# EAGLE design RAK833BACKPLANE (EAGLE 9.5.2)
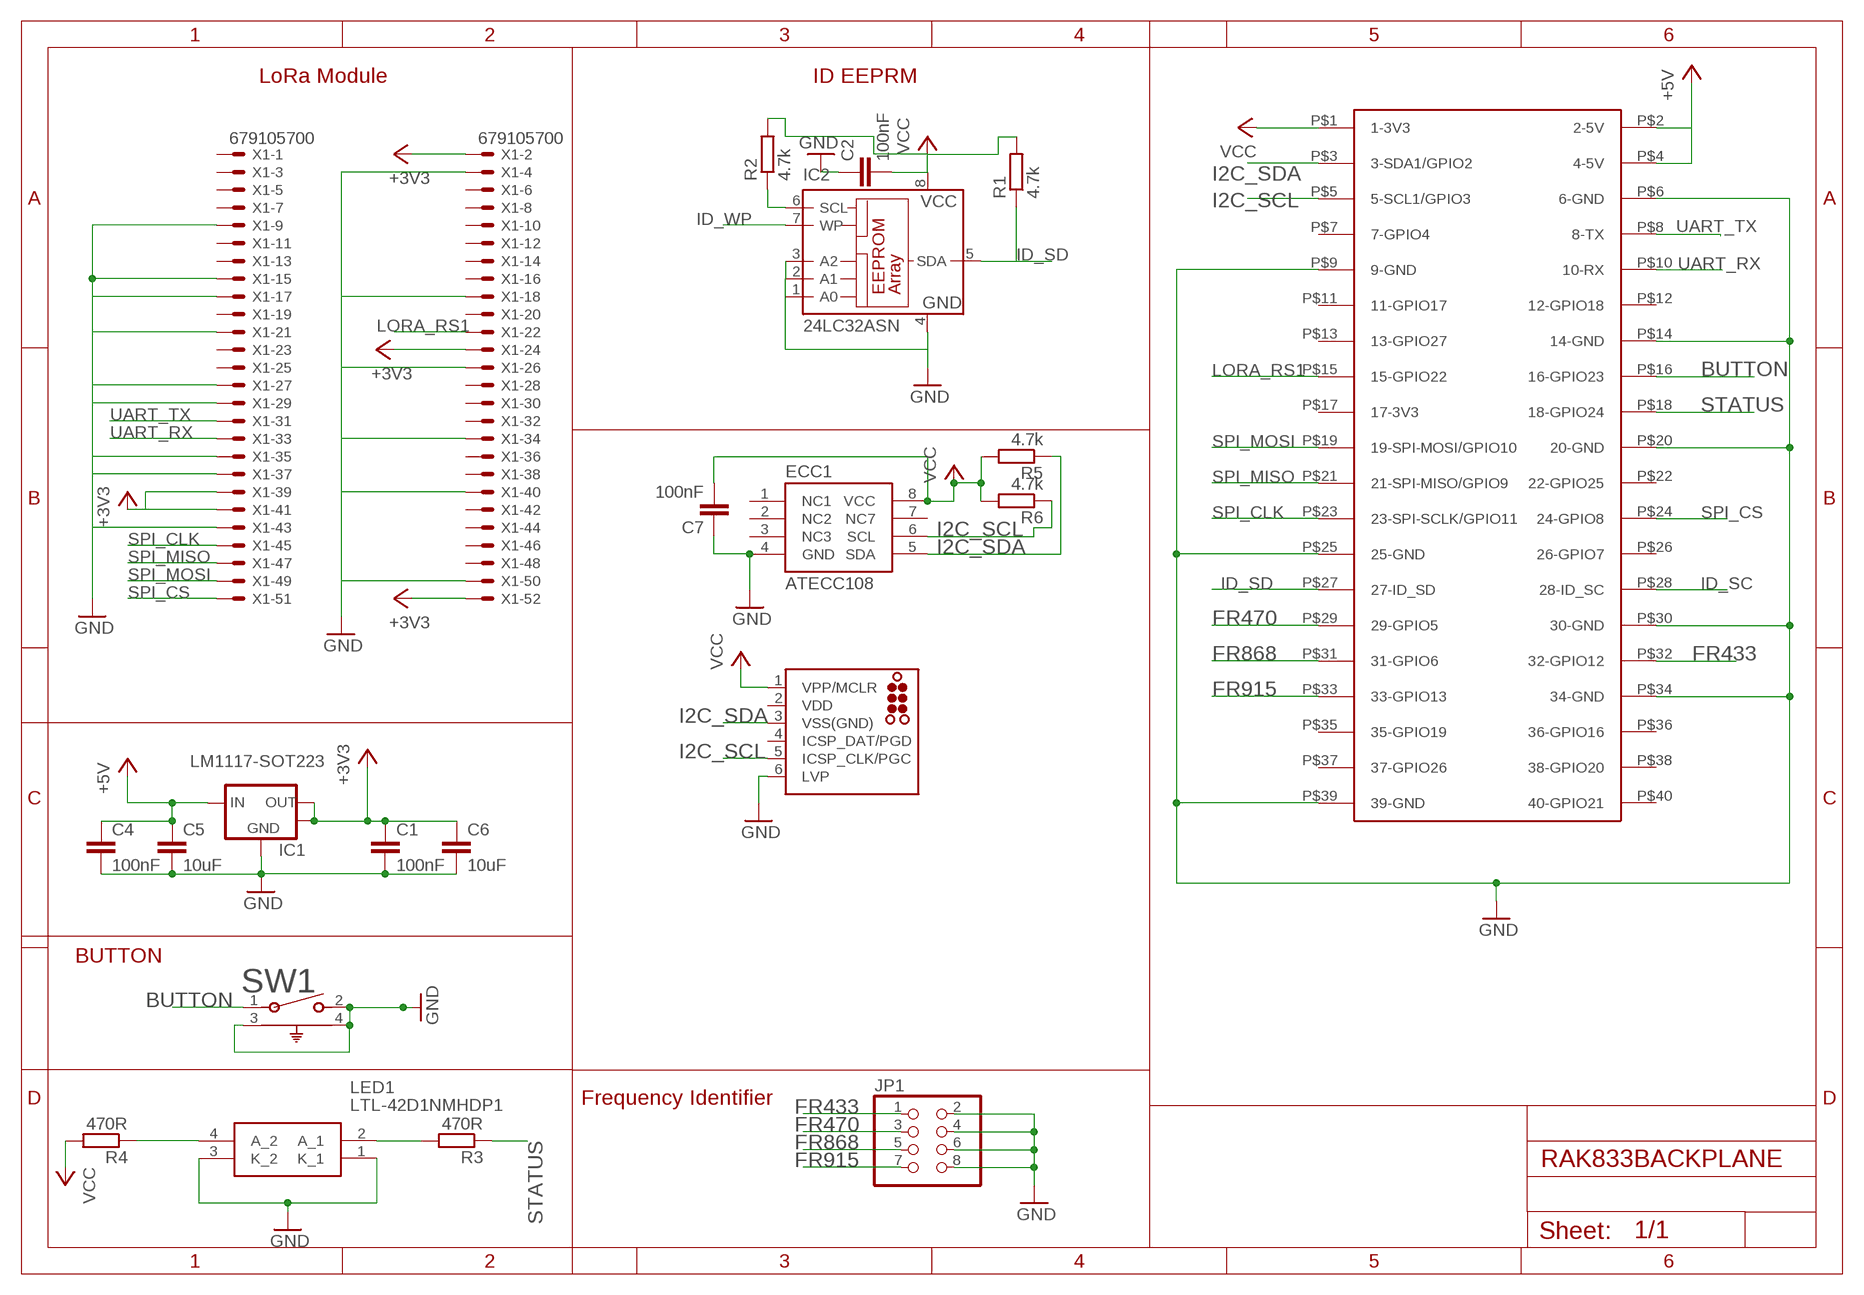
[diagram p0: schematic, sheet 1]

## Parts
C1  100nF  C-EUC0402  [C0402]
C2  100nF  C-EUC0402  [C0402]
C4  100nF  C-EUC0402  [C0402]
C5  10uF  C-EUC0603  [C0603]
C6  10uF  C-EUC0603  [C0603]
C7  100nF  C-EUC0402  [C0402]
ECC1  ATECC108  [SO08]
IC1  LM1117-SOT223  [SOT-223-3]
IC2  24LC32ASN  [SO-08]
J1  TC2030-MCP-NL  [TC2030-MCP-NL]
JP1  PINHD-2X4  [2X04]
LED1  LTL-42D1NMHDP1  [LTL42D1NMHDP1]
R1  4.7k  R-EU_R0402  [R0402]
R2  4.7k  R-EU_R0402  [R0402]
R3  470R  R-EU_R0402  [R0402]
R4  470R  R-EU_R0402  [R0402]
R5  4.7k  R-EU_R0402  [R0402]
R6  4.7k  R-EU_R0402  [R0402]
SW1  1825027-8  [SW2_1825027-C_TEC]
U$2  RASPBERRY-PI+  [RASPBERRY-PI-PLUS-CAM_NOTCH]
X1  679105700  [679105700]

## Nets
+3V3: C1.1 C6.1 IC1.2(VOUT) IC1.4(HEATSINK) X1.2 X1.24 X1.39 X1.41 X1.52
+5V: C4.1 C5.1 IC1.3(VIN) U$2.P$2(2-5V) U$2.P$4(4-5V)
BUTTON: SW1.1 U$2.P$16(16-GPIO23)
FR433: JP1.1 U$2.P$32(32-GPIO12)
FR470: JP1.3 U$2.P$29(29-GPIO5)
FR868: JP1.5 U$2.P$31(31-GPIO6)
FR915: JP1.7 U$2.P$33(33-GPIO13)
GND: C1.2 C2.1 C4.2 C5.2 C6.2 C7.1 ECC1.4(GND) IC1.1(GND) IC2.1(A0) IC2.2(A1) IC2.3(A2) IC2.4(GND) J1.6(LVP) JP1.2 JP1.4 JP1.6 JP1.8 LED1.1(K_1) LED1.3(K_2) SW1.2 SW1.3 SW1.4 U$2.P$6(6-GND) U$2.P$9(9-GND) U$2.P$14(14-GND) U$2.P$20(20-GND) U$2.P$25(25-GND) U$2.P$30(30-GND) U$2.P$34(34-GND) U$2.P$39(39-GND) X1.4 X1.9 X1.15 X1.17 X1.21 X1.26 X1.27 X1.29 X1.34 X1.35 X1.37 X1.40 X1.43 X1.50
I2C_SCL: ECC1.6(SCL) J1.5(ICSP_CLK/PGC) R6.1 U$2.P$5(5-SCL1/GPIO3)
I2C_SDA: ECC1.5(SDA) J1.3(VSS(GND)) R5.1 U$2.P$3(3-SDA1/GPIO2)
ID_SC: IC2.6(SCL) R2.1 U$2.P$28(28-ID_SC)
ID_SD: IC2.5(SDA) R1.1 U$2.P$27(27-ID_SD)
ID_WP: IC2.7(WP)
LORA_RS1: U$2.P$15(15-GPIO22) X1.22
N$1: LED1.4(A_2) R4.1
N$2: LED1.2(A_1) R3.2
N$6: X1.18
SPI_CLK: U$2.P$23(23-SPI-SCLK/GPIO11) X1.45
SPI_CS: U$2.P$24(24-GPIO8) X1.51
SPI_MISO: U$2.P$21(21-SPI-MISO/GPIO9) X1.47
SPI_MOSI: U$2.P$19(19-SPI-MOSI/GPIO10) X1.49
STATUS: R3.1 U$2.P$18(18-GPIO24)
UART_RX: U$2.P$10(10-RX) X1.33
UART_TX: U$2.P$8(8-TX) X1.31
VCC: C2.2 C7.2 ECC1.8(VCC) IC2.8(VCC) J1.1(VPP/MCLR) R1.2 R2.2 R4.2 R5.2 R6.2 U$2.P$1(1-3V3)
Unconnected: ECC1.1(NC1) ECC1.2(NC2) ECC1.3(NC3) ECC1.7(NC7) J1.4(ICSP_DAT/PGD) U$2.P$7(7-GPIO4) U$2.P$11(11-GPIO17) U$2.P$12(12-GPIO18) U$2.P$13(13-GPIO27) U$2.P$17(17-3V3) U$2.P$22(22-GPIO25) U$2.P$26(26-GPIO7) U$2.P$35(35-GPIO19) U$2.P$36(36-GPIO16) U$2.P$37(37-GPIO26) U$2.P$38(38-GPIO20) U$2.P$40(40-GPIO21) X1.1 X1.3 X1.5 X1.6 X1.7 X1.8 X1.10 X1.11 X1.12 X1.13 X1.14 X1.16 X1.19 X1.20 X1.23 X1.25 X1.28 X1.30 X1.32 X1.36 X1.38 X1.42 X1.44 X1.46 X1.48

## Notes on the sheet
- LoRa Module | ID EEPRM
- BUTTON
- Frequency Identifier

## Power pins joined to a net without a drawn wire
VDD: J1.2(VDD)

## Library data of the parts
C1 C2 C4-C7 = resistor:C-EU: CAPACITOR, European symbol
ECC1 = SparkFun-IC-Special-Function:ATECC108: ATECC108 ECDSA with NIST ATECC108: Provides ECDSA with NIST curves P256, B283, and K283. Also, a RNG, 8.5Kb EEPROM. 2.0V - 5.5V. Datasheet <https://cdn.sparkfun.com/datasheets/Dev/Beagle/Atmel-8873S-CryptoAuth-ATECC108-Datasheet-Summary.pdf> SparkFun Products CryptoCape <https://www.sparkfun.com/products/12773> (DEV-12773) SparkFun CryptoShield <https://www.sparkfun.com/products/13183> (DEV-13183); PROD_ID: IC-11982
IC1 = bt_regulator:LM1117: LDO Voltage Regulator NCP1117 series are low dropout positive voltage regulators that are capable of providing an output current that is in excess of 1.0 A with a maximum dropout voltage of 1.2 V at 800 mA over temperature. This series contains nine fixed output voltages of 1.5 V, 1.8 V, 1.9 V, 2.0 V, 2.5 V, 2.85 V, 3.3 V, 5.0 V, and 12 V that have no minimum load requirement to maintain regulation. Also included is an adjustable output version that can be programmed from 1.25 V to 18.8 V with two external resistors. datasheet.pdf <http://www.onsemi.com/pub_link/Collateral/NCP1117-D.PDF> LM1117-N is a series of low dropout voltage regulators of 1.2V at 800mA of load current. It has the same pin-out as Texas Instruments' industry standard LM317. The LM1117-N is available in an adjustable version, available in five fixed voltages, 1.8V, 2.5V, 2.85V, 3.3V, and 5V. The LM1117-N offers current limiting and thermal shutdown. Its circuit includes a zener trimmed to within ±1%. datasheet.pdf <http://www.ti.com/lit/ds/symlink/lm1117-n.pdf>
IC2 = microchip:24*: Serial EEPROM I2C; MF: MICROCHIP; MPN: 24LC32A/SN; OC_FARNELL: 9758003; OC_NEWARK: 33C2976
J1 = One_Dimensional_Pong:TC2030: TAG-CONNECT ICSP Connector Manufacturer: Tag-Connect <http://www.tag-connect.com> Cable for easy In-Circuit Serial Programming. Designed for Microchip ICD2, suitable for many others. Two variants - one "with legs" (for hands-free fit on PCB) and another "without legs" for quick programming. PAD Description 1 MCLR/Vpp 2 Vdd 3 GND 4 PGD (ISPDAT) 5 PGC (ISPCLK) 6 nc (used for LVP) ©2009 ROFA.cz - modified and updated by Robert Darlington ‹rdarlington@gmail.com›
JP1 = pinhead:PINHD-2X4: PIN HEADER
LED1 = LTL-42D1NMHDP1:LTL-42D1NMHDP1: LED Circuit Board Indicators Housing LED ThruHole 3mm 2Lvl Grn/Yellow Source: Datasheet <https://datasheet.datasheetarchive.com/originals/distributors/Datasheets-305/79387.pdf>; ARROW_PART_NUMBER: LTL-42D1NMHDP1; ARROW_PRICE-STOCK: https://www.arrow.com/en/products/ltl-42d1nmhdp1/lite-on-technology; DESCRIPTION: LED Circuit Board Indicators Housing LED ThruHole 3mm 2Lvl Grn/Yellow; HEIGHT: 9.6mm; MANUFACTURER_NAME: Lite-On; MANUFACTURER_PART_NUMBER: LTL-42D1NMHDP1; MOUSER_PART_NUMBER: 859-LTL-42D1NMHDP1; MOUSER_PRICE-STOCK: https://www.mouser.co.uk/ProductDetail/Lite-On/LTL-42D1NMHDP1?qs=WxFF5lh7QM1L2xMrizlF%2FQ%3D%3D
R1-R6 = resistor:R-EU_: RESISTOR, European symbol
SW1 = ryanteck:1825027-8; BUILT_BY: EMA_UL_Team; CONFIGURATION__POLE-THROW_: Single Pole - Single Throw; COPYRIGHT: Copyright (C) 2016 Accelerated Designs. All rights reserved; DESCRIPTION: FSMRA3JH04=R/A,TACT PB SW,160G; MANUFACTURER_PART_NUMBER: 1825027-8; MAX_SWITCHING_CURRENT: -; MAX_SWITCHING_VOLTAGE_AC_: -; PRODUCT_TYPE: Switch; SOURCELIBRARY: TE_Connectivity-2018-03-16; SWITCH_TYPE: Tactile Switches; TE_PART_NUMBER: 1825027-8; VENDOR: TE Connectivity
U$2 = Ava:RASPBERRY-PI+: Samtec SSW-120-01-T-D
X1 = con-molex-3:679105700: MINI PCI EXPRESS CONNECTOR 0.8MM PITCH, 52 CIRCUIT Source: http://www.molex.com/pdm_docs/sd/679105700_sd.pdf; MPN: 67910-5700; OC_FARNELL: unknown; OC_NEWARK: 93M2128

## Board
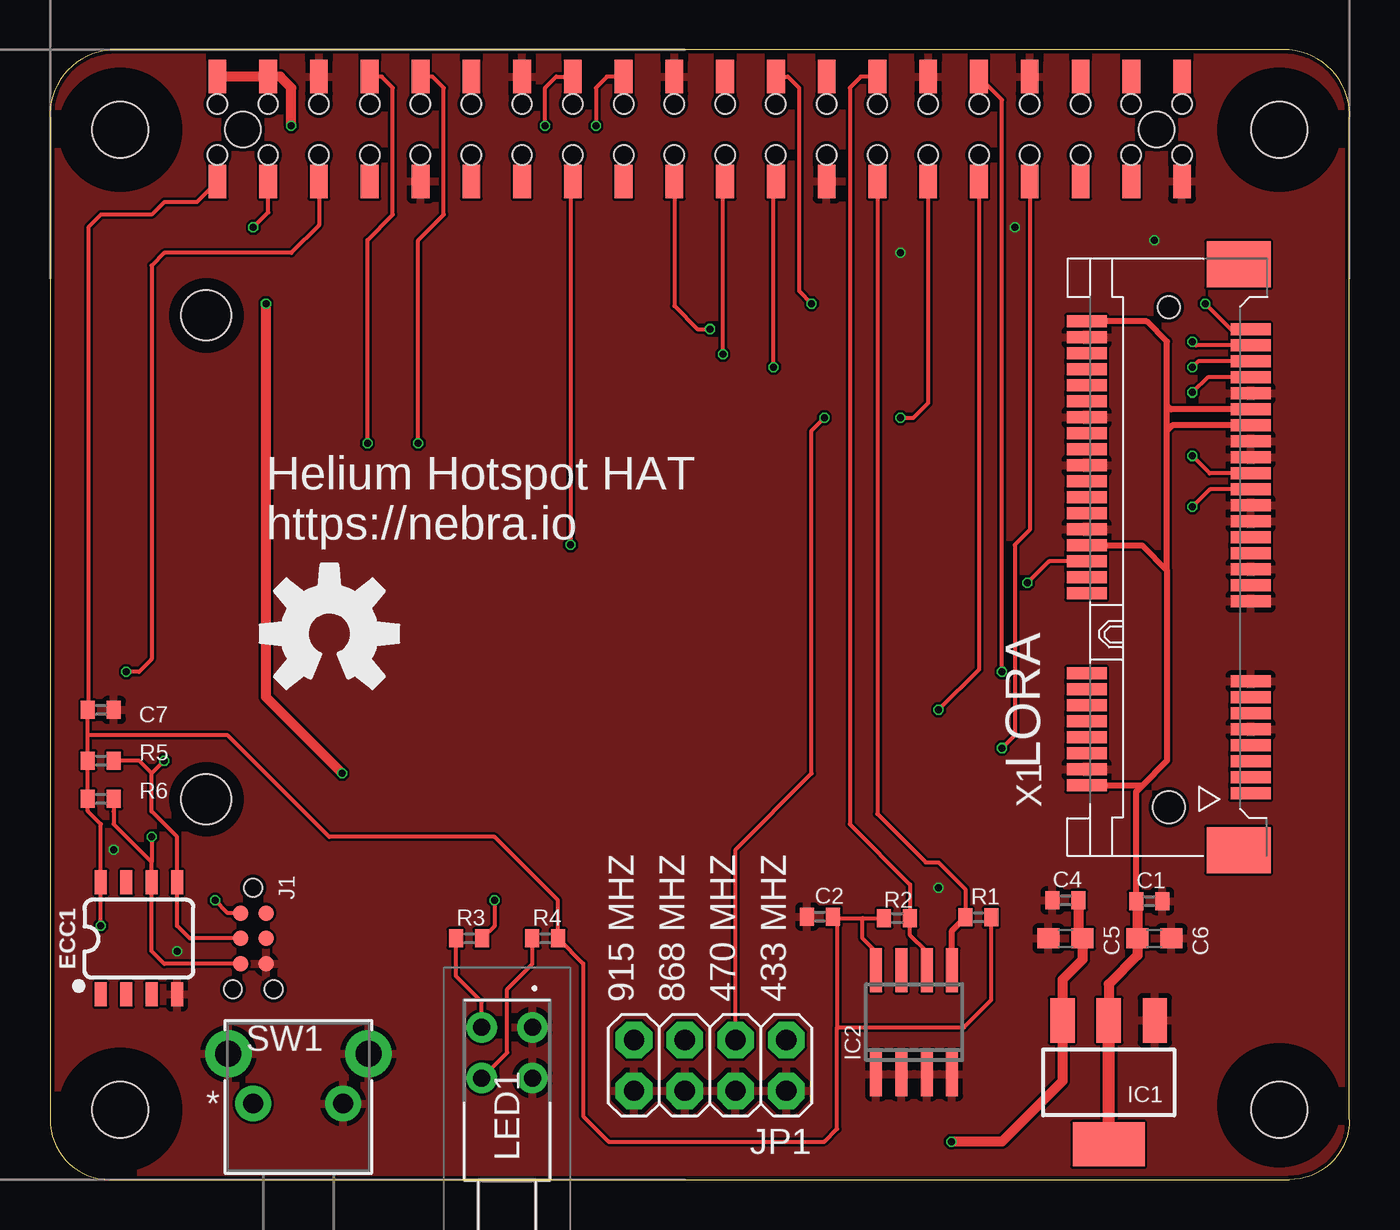
[diagram p1: board, top side]
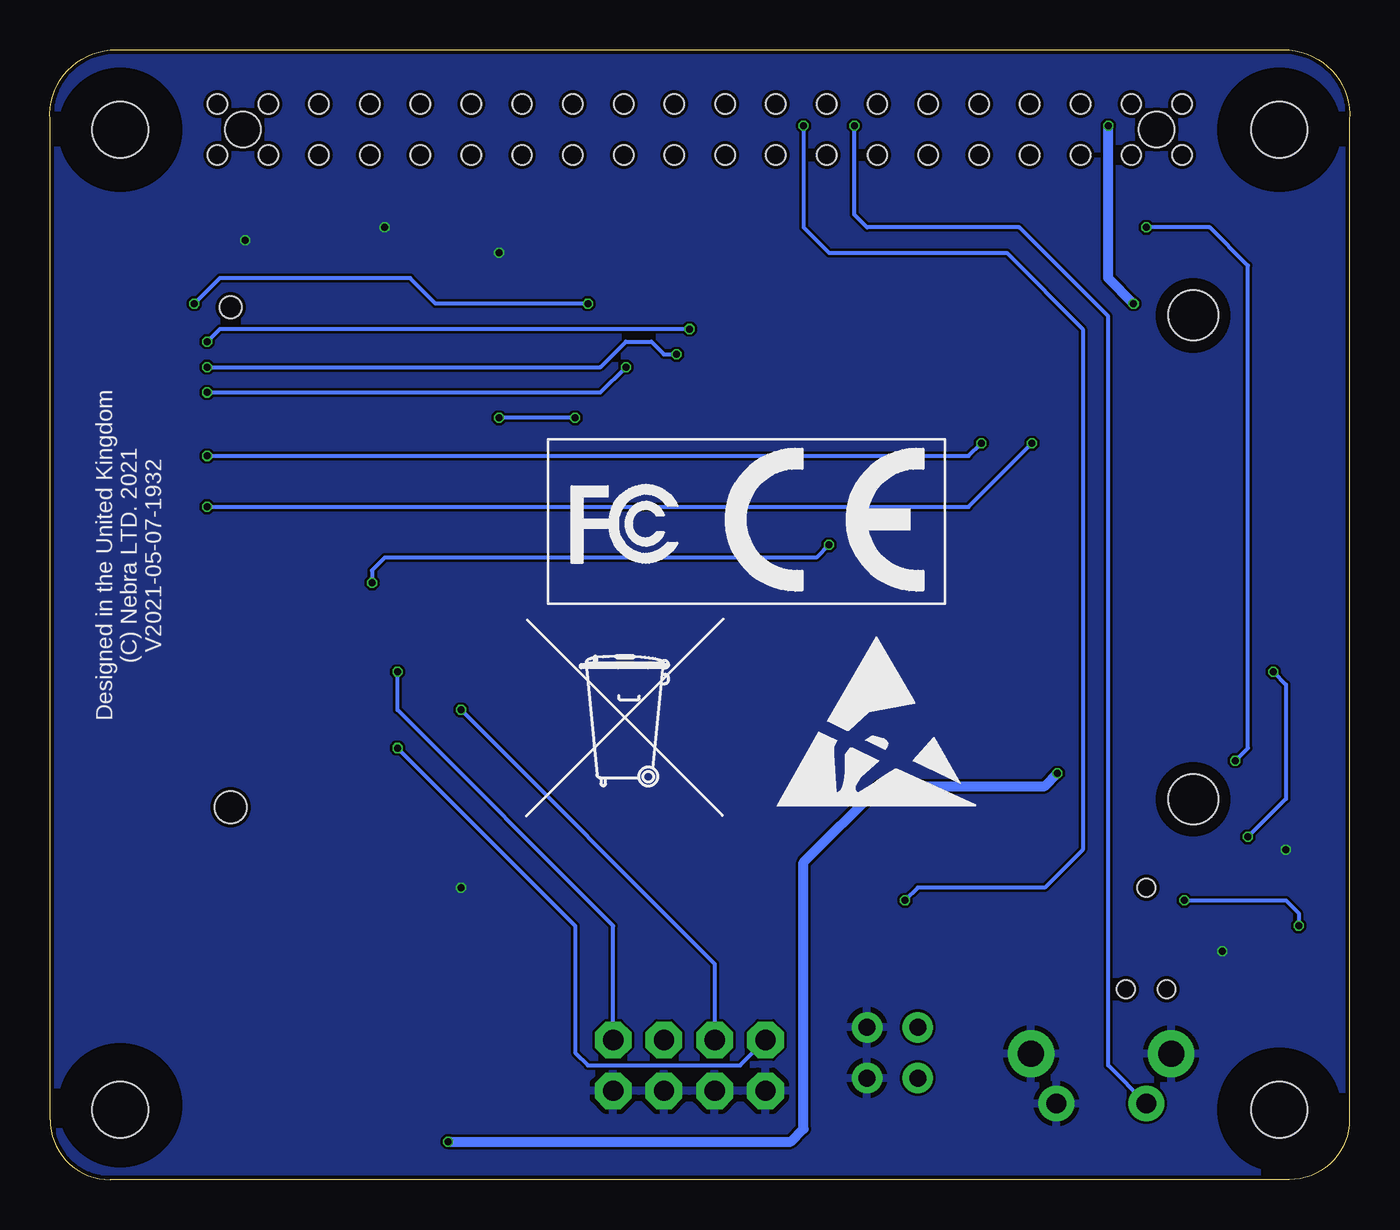
[diagram p2: board, bottom side, seen from below]

Size 65.02 x 56.5 mm. Coordinates in mm from the lower left corner, seen from the top.
Outline: 65.01,3 65.01,53 arc90 62.01,56.5 3.01,56.5 arc90 0.01,53 0.01,3 arc90 3.01,0 62.01,0 arc90 65.01,3
Copper layers (1*16): Top 0.035mm / dielectric 1.6mm / Bottom 0.035mm
Design rules "jlcpcb-2layers": minimum track width 5mil, minimum drill 0.3mm, track to track 5mil, track to pad 5mil, pad to pad 5mil, via to via 5mil, smd to smd 5mil, copper to edge 0.2mm, drill to drill 6mil, minimum pad ring 10mil, minimum via ring 3mil, stop-mask expansion 4mil, vias tented up to drill 0mil, thermal gap 10mil
Holes 2.8 mm at 3.51,52.5 61.51,52.5 3.51,3.5 61.51,3.5
tRestrict: area 2,51 to 5.1,54; area 60,2.2 to 63.1,5.3; area 2,1.9 to 5.1,5; area 60,51 to 63.1,54
bRestrict: area 60,51 to 63.1,54; area 2,1.9 to 5.1,5; area 2,51 to 5.1,54; area 2,1.9 to 5.1,5; area 60,2.2 to 63.1,5.3

### Footprints (pad centres in the part's own frame; a part is rotated, then mirrored left to right if it is on the bottom)
C0402 = smd 0.7 x 0.9: 1 -0.65,0; 2 0.65,0
C0603 = smd 1.1 x 1: 1 -0.85,0; 2 0.85,0
SO08 = smd 0.6 x 1.2: 1 -1.905,-2.8; 2 -0.635,-2.8; 3 0.635,-2.8; 4 1.905,-2.8; 5 1.905,2.8; 6 0.635,2.8; 7 -0.635,2.8; 8 -1.905,2.8
SOT-223-3 = smd 1.219 x 2.235: 1 -2.311,-3.099; 2 0,-3.099; 3 2.311,-3.099 | smd 3.6 x 2.2: 4 0,3.099
SO-08 = smd 0.6 x 2.2: 1 -1.905,-2.6; 2 -0.635,-2.6; 3 0.635,-2.6; 4 1.905,-2.6; 5 1.905,2.6; 6 0.635,2.6; 7 -0.635,2.6; 8 -1.905,2.6
TC2030-MCP-NL = smd 0.787 x 0.787: 1 1.27,-0.635; 2 1.27,0.635; 3 2.54,-0.635; 4 2.54,0.635; 5 3.81,-0.635; 6 3.81,0.635 | hole 0.889: 0,0; 5.08,-1.016; 5.08,1.016
2X04 = drill 1.016 octagon: 1 -3.81,-1.27; 2 -3.81,1.27; 3 -1.27,-1.27; 4 -1.27,1.27; 5 1.27,-1.27; 6 1.27,1.27; 7 3.81,-1.27; 8 3.81,1.27
LTL42D1NMHDP1 = drill 0.85 pad 1.381: 1 0,0; 2 0,2.54; 3 -2.54,0; 4 -2.54,2.54
R0402 = smd 0.7 x 0.9: 1 -0.65,0; 2 0.65,0
SW2_1825027-C_TEC = drill 0.991 pad 1.499: 1 0,0; 2 4.496,0 | drill 1.295 pad 1.803: 3 -1.245,2.489; 4 5.766,2.489
RASPBERRY-PI-PLUS-CAM_NOTCH = smd 0.889 x 1.68: P$1 -23.97,-2.225; P$2 -23.97,3.015; P$3 -21.43,-2.225; P$4 -21.43,3.015; P$5 -18.89,-2.225; P$6 -18.89,3.015; P$7 -16.35,-2.225; P$8 -16.35,3.015; P$9 -13.81,-2.225; P$10 -13.81,3.015; P$11 -11.27,-2.225; P$12 -11.27,3.015; P$13 -8.73,-2.225; P$14 -8.73,3.015; P$15 -6.19,-2.225; P$16 -6.19,3.015; P$17 -3.65,-2.225; P$18 -3.65,3.015; P$19 -1.11,-2.225; P$20 -1.11,3.015; P$21 1.43,-2.225; P$22 1.43,3.015; P$23 3.97,-2.225; P$24 3.97,3.015; P$25 6.51,-2.225; P$26 6.51,3.015; P$27 9.05,-2.225; P$28 9.05,3.015; P$29 11.59,-2.225; P$30 11.59,3.015; P$31 14.13,-2.225; P$32 14.13,3.015; P$33 16.67,-2.225; P$34 16.67,3.015; P$35 19.21,-2.225; P$36 19.21,3.015; P$37 21.75,-2.225; P$38 21.75,3.015; P$39 24.29,-2.225; P$40 24.29,3.015 | hole 1.78: -22.7,0.37; 23.02,0.37 | hole 0.97: -23.97,1.64; -21.43,1.64; -18.89,1.64; -16.35,1.64; -13.81,1.64; -11.27,1.64; -8.73,1.64; -6.19,1.64; -3.65,1.64; -1.11,1.64; 1.43,1.64; 3.97,1.64; 6.51,1.64; 9.05,1.64; 11.59,1.64; 14.13,1.64; 16.67,1.64; 19.21,1.64; 21.75,1.64; 24.29,1.64; -23.97,-0.9; -21.43,-0.9; -18.89,-0.9; -16.35,-0.9; -13.81,-0.9; -11.27,-0.9; -8.73,-0.9; -6.19,-0.9; -3.65,-0.9; -1.11,-0.9; 1.43,-0.9; 3.97,-0.9; 6.51,-0.9; 9.05,-0.9; 11.59,-0.9; 14.13,-0.9; 16.67,-0.9; 19.21,-0.9; 21.75,-0.9; 24.29,-0.9
679105700 = smd 0.6 x 2: 1 0.7,-4.1; 2 1.1,4.1; 3 1.5,-4.1; 4 1.9,4.1; 5 2.3,-4.1; 6 2.7,4.1; 7 3.1,-4.1; 8 3.5,4.1; 9 3.9,-4.1; 10 4.3,4.1; 11 4.7,-4.1; 12 5.1,4.1; 13 5.5,-4.1; 14 5.9,4.1; 15 6.3,-4.1; 16 6.7,4.1; 17 10.3,-4.1; 18 10.7,4.1; 19 11.1,-4.1; 20 11.5,4.1; 21 11.9,-4.1; 22 12.3,4.1; 23 12.7,-4.1; 24 13.1,4.1; 25 13.5,-4.1; 26 13.9,4.1; 27 14.3,-4.1; 28 14.7,4.1; 29 15.1,-4.1; 30 15.5,4.1; 31 15.9,-4.1; 32 16.3,4.1; 33 16.7,-4.1; 34 17.1,4.1; 35 17.5,-4.1; 36 17.9,4.1; 37 18.3,-4.1; 38 18.7,4.1; 39 19.1,-4.1; 40 19.5,4.1; 41 19.9,-4.1; 42 20.3,4.1; 43 20.7,-4.1; 44 21.1,4.1; 45 21.5,-4.1; 46 21.9,4.1; 47 22.3,-4.1; 48 22.7,4.1; 49 23.1,-4.1; 50 23.5,4.1; 51 23.9,-4.1; 52 24.3,4.1 | smd 2.3 x 3.2: M1 27.15,-3.5; M2 -2.15,-3.5 | hole 1.6: 0,0 | hole 1.1: 25,0 | hole 2.5: 0.4,48.15; 24.6,48.15

### Placement (x,y rotation side)
C1  55,13.93 0 top
C2  38.52,13.16 0 top
C4  50.81,13.97 180 top
C5  50.81,12.06 180 top
C6  55.25,12.06 0 top
C7  2.55,23.5 180 top
ECC1  4.45,12.06 0 top
IC1  52.97,4.87 180 top
IC2  43.23,7.87 0 top
J1  10.17,14.61 270 top
JP1  33.03,5.71 180 top
LED1  24.14,7.62 90 top
R1  46.45,13.12 0 top
R2  42.38,13.08 180 top
R3  20.96,12.06 180 top
R4  24.77,12.06 0 top
R5  2.55,20.95 180 top
R6  2.55,19.05 180 top
SW1  10.17,3.81 0 top
U$1  [TONNE_10.00]  36.37,21.12 0 bottom
U$2  32.35,52.15 0 top
U$3  [ESD_10.00]  28.75,18.58 0 bottom
U$4  [CE_7.3MM]  31.29,29.38 0 bottom
U$5  [FCC_20X8.35MM]  40.18,28.74 0 bottom
U$6  [OSHW-LOGO-L]  13.98,27.3 0 top
X1  55.97,18.63 90 top

### Tracks (layer width: path | path; a pad name or v marks a point on that pad's centre or on a via)
+3V3
  Top 0.305: C1.1 54.35,19.41 54.62,19.68 | 54.62,19.68 55.89,20.95 55.89,30.48 | X1.2 54.58,19.73 54.62,19.68 | X1.24 54.64,31.73 55.89,30.48 | X1.52 54.87,42.93 55.89,41.91 55.89,38.73 | 55.89,30.48 55.89,37.47 | 55.89,37.47 55.89,38.73 | X1.41 56.1,38.53 55.89,38.73 | X1.39 56.15,37.73 55.89,37.47
  Top 0.508: C1.1 54.4,13.88 C6.1 54.4,11.21 52.97,9.78 IC1.2
  Top 0.61: IC1.4 IC1.2
+5V  (via drill 0.35)
  Top 0.508: C4.1 51.46,12.27 C5.1 51.66,11.01 50.66,10.01 IC1.3 50.66,4.93 47.63,1.91 v45.09,1.91 | v14.61,20.32 10.8,24.13 v10.8,43.81 | v12.07,52.7 12.07,54.61 11.52,55.16 U$2.P$4 U$2.P$2
  Bottom 0.508: v45.09,1.91 27.95,1.91 27.31,2.54 27.31,15.88 23.5,19.68 15.25,19.68 v14.61,20.32 | v10.8,43.81 12.07,45.09 v12.07,52.7
BUTTON  (via drill 0.35)
  Top 0.203: v24.77,52.7 24.77,54.61 25.33,55.16 U$2.P$16
  Bottom 0.203: SW1.1 12.07,5.71 12.07,43.18 16.52,47.62 24.14,47.62 24.77,48.26 v24.77,52.7
FR433  (via drill 0.35)
  Top 0.203: v47.63,25.4 47.63,54.01 U$2.P$32
  Bottom 0.203: JP1.1 36.84,12.7 47.63,23.5 v47.63,25.4
FR470  (via drill 0.35)
  Top 0.203: JP1.3 34.3,16.51 38.11,20.32 38.11,37.47 v38.74,38.1 | v42.55,38.1 43.19,38.1 43.94,38.85 U$2.P$29
  Bottom 0.203: v38.74,38.1 v42.55,38.1
FR868  (via drill 0.35)
  Top 0.203: U$2.P$31 46.48,25.51 v44.46,23.5
  Bottom 0.203: v44.46,23.5 31.76,10.79 JP1.5
FR915  (via drill 0.35)
  Top 0.203: U$2.P$33 49.02,32.5 48.27,31.75 48.27,22.23 v47.63,21.59
  Bottom 0.203: v47.63,21.59 38.74,12.7 38.74,6.35 38.11,5.71 30.49,5.71 JP1.7
GND  (via drill 0.35)
  other vias: 42.55,46.35 44.46,14.61 48.27,47.62 55.25,46.99 3.18,16.51 6.36,11.43
  pour Top: -1.65,58.72 -2,-1.77 67.57,-1.24 68.37,59.3
  pour Bottom: -1.82,59.31 -1.55,-1.9 66.81,-1.52 66.02,59.86
I2C_SCL  (via drill 0.35)
  Top 0.203: J1.5 5.72,10.79 5.09,11.43 ECC1.6 5.09,15.88 | 5.09,15.88 3.18,17.78 3.18,18.41 3.2,18.43 R6.1 | U$2.P$5 13.46,47.74 12.07,46.35 5.72,46.35 5.09,45.72 5.09,26.04 4.45,25.4 v3.82,25.4 | v5.09,17.14 5.09,15.88
  Bottom 0.203: v3.82,25.4 3.18,24.77 3.18,19.05 v5.09,17.14
I2C_SDA  (via drill 0.35)
  Top 0.203: J1.3 6.99,12.06 6.36,12.7 ECC1.5 6.36,17.14 5.09,18.41 5.09,20.32 | 5.09,20.32 4.45,20.95 R5.1 | 5.09,20.32 v5.72,20.95 | U$2.P$3 10.92,48.37 v10.17,47.62
  Bottom 0.203: v5.72,20.95 5.09,21.59 5.09,45.72 6.99,47.62 v10.17,47.62
ID_SC
  Top 0.203: IC2.6 43.87,11.39 43.03,12.22 R2.1 43.03,14.76 40.01,17.78 40.01,54.61 40.57,55.16 U$2.P$28
ID_SD
  Top 0.203: U$2.P$27 41.4,18.3 43.82,15.88 44.46,15.88 45.8,14.54 R1.1
  Top 0.305: IC2.5 45.14,12.46 R1.1
LORA_RS1  (via drill 0.35)
  Top 0.203: U$2.P$15 26.04,49.81 v26.04,31.75 | X1.22 49.99,30.93 v48.9,29.84
  Bottom 0.203: v26.04,31.75 26.68,31.11 48.27,31.11 48.9,30.48 v48.9,29.84
N$1
  Top 0.203: LED1.4 22.87,6.35 22.87,9.53 24.14,10.79 R4.1
N$2
  Top 0.203: LED1.2 21.6,8.89 20.31,10.18 R3.2
SPI_CLK  (via drill 0.35)
  Top 0.203: X1.45 57.92,40.13 v57.16,39.37 | v36.2,40.64 36.2,49.81 U$2.P$23
  Bottom 0.203: v57.16,39.37 37.47,39.37 v36.2,40.64
SPI_CS  (via drill 0.35)
  Top 0.203: U$2.P$24 36.92,55.16 37.47,54.61 37.47,44.45 v38.11,43.81 | v57.79,43.81 59.08,42.53 X1.51
  Bottom 0.203: v38.11,43.81 45.73,43.81 47,45.09 56.52,45.09 v57.79,43.81
SPI_MISO  (via drill 0.35)
  Top 0.203: X1.47 57.45,40.93 v57.16,40.64 | v33.66,41.27 33.66,49.81 U$2.P$21
  Bottom 0.203: v57.16,40.64 37.47,40.64 36.2,41.91 34.93,41.91 34.3,41.27 v33.66,41.27
SPI_MOSI  (via drill 0.35)
  Top 0.203: U$2.P$19 31.24,43.7 32.39,42.55 v33.03,42.55 | X1.49 57.34,41.73 v57.16,41.91
  Bottom 0.203: v33.03,42.55 56.52,42.55 v57.16,41.91
STATUS  (via drill 0.35)
  Top 0.203: U$2.P$18 27.87,55.16 27.31,54.61 v27.31,52.7 | v22.23,13.97 22.23,12.69 R3.1
  Bottom 0.203: v27.31,52.7 27.31,47.62 26.04,46.35 17.15,46.35 13.34,42.55 13.34,16.51 15.25,14.61 21.6,14.61 v22.23,13.97
UART_RX  (via drill 0.35)
  Top 0.203: X1.33 58.03,35.33 v57.16,36.2 | v18.42,36.83 18.42,46.99 19.69,48.26 19.69,54.61 19.14,55.16 U$2.P$10
  Bottom 0.203: v18.42,36.83 19.06,36.2 v57.16,36.2
UART_TX  (via drill 0.35)
  Top 0.203: X1.31 58.03,34.53 v57.16,33.66 | v15.88,36.83 15.88,46.99 17.15,48.26 17.15,54.61 16.6,55.16 U$2.P$8
  Bottom 0.203: v57.16,33.66 19.06,33.66 v15.88,36.83
VCC  (via drill 0.35)
  Top 0.203: 1.9,22.23 C7.2 1.91,23.51 1.91,47.62 2.55,48.26 5.09,48.26 5.72,48.9 7.35,48.9 U$2.P$1 | 1.9,22.23 8.9,22.23 13.98,17.14 22.23,17.14 25.41,13.97 25.41,12.08 R4.2 26.68,10.81 26.68,3.17 27.95,1.91 38.74,1.91 39.38,2.54 39.38,7.62 | 1.9,22.23 R5.2 R6.2 1.9,18.43 2.55,17.78 ECC1.8 v2.55,12.7 | J1.1 8.9,13.34 v8.26,13.97 | 39.38,7.62 39.38,12.95 C2.2 39.25,13.08 40.65,13.08 | 40.65,13.08 R2.2 | IC2.8 41.33,11.39 40.65,12.06 40.65,13.08 | 39.38,7.62 45.73,7.62 47.1,8.99 R1.2
  Bottom 0.203: v8.26,13.97 3.18,13.97 2.55,13.34 v2.55,12.7

### Text on the board
tNames: Helium Hotspot HAT / https://nebra.io | LORA | 915 MHZ | 868 MHZ | 470 MHZ | 433 MHZ
bNames: Designed in the United Kingdom / (C) Nebra LTD. 2021 / V2021-05-07-1932